# Altium schematic sheet Zigbee.SchDoc
size A3
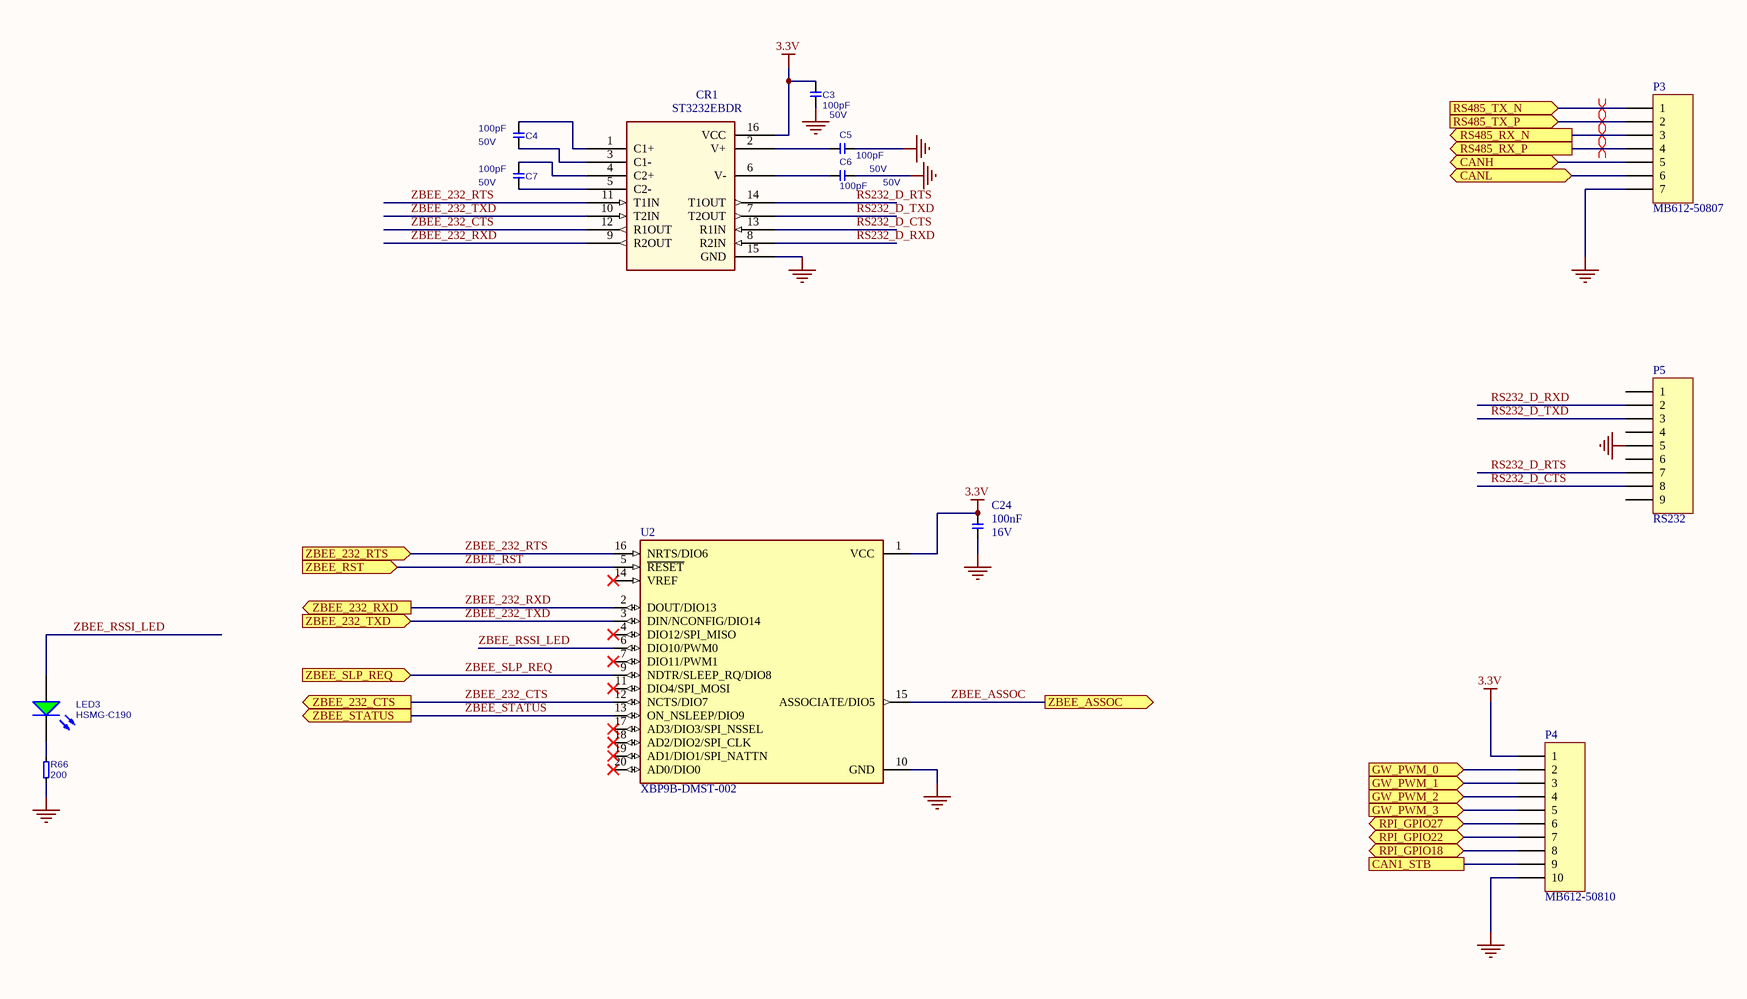
[diagram p0: Zigbee.SchDoc]

## Parts
C3  Rating: 50V  [CAPC1005X60N]  (hidden comment: 100pF)
C4  Rating: 50V  [CAPC1005X60N]  (hidden comment: 100pF)
C5  Rating: 50V  [CAPC1005X60N]  (hidden comment: 100pF)
C6  Rating: 50V  [CAPC1005X60N]  (hidden comment: 100pF)
C7  Rating: 50V  [CAPC1005X60N]  (hidden comment: 100pF)
C24  Rating: 16V  [T_CAPC0603X33N]  (hidden comment: 100nF)
CR1  ST3232EBDR  [SO-16_STM]
LED3  Manufacturer Part No.: HSMG-C190  [LEDC1608X80N]  (hidden comment: LED)
P3  MB612-50807  [MB612-50807]
P4  MB612-50810  [1729186 5.08 - 10pos]
P5  RS232  [2301843-1]
R66  200  [RESC1005X40N]
U2  XBP9B-DMST-002  [DIP2200W51P200L3294H279Q20P]

## Ports
CAN1_STB, CANH (bidir), CANL (bidir), GW_PWM_0 (in), GW_PWM_1 (in), GW_PWM_2 (in), GW_PWM_3 (in), RPI_GPIO18 (bidir), RPI_GPIO22 (bidir), RPI_GPIO27 (bidir), RS485_RX_N (out), RS485_RX_P (out), RS485_TX_N (in), RS485_TX_P (in), ZBEE_232_CTS (out), ZBEE_232_RTS (in), ZBEE_232_RXD (out), ZBEE_232_TXD (in), ZBEE_ASSOC (out), ZBEE_RST (in), ZBEE_SLP_REQ (in), ZBEE_STATUS (out)

## Nets
3.3V: C3.1 C24.2 CR1.16(VCC) P4.1 U2.1(VCC)
GND: C3.2 C5.1 C6.1 C24.1 CR1.15(GND) P3.7 P4.10 P5.5 R66.2 U2.10(GND)
CAN1_STB: P4.9 ; port CAN1_STB
CANH: P3.5 ; port CANH
CANL: P3.6 ; port CANL
GW_PWM_0: P4.2 ; port GW_PWM_0
GW_PWM_1: P4.3 ; port GW_PWM_1
GW_PWM_2: P4.4 ; port GW_PWM_2
GW_PWM_3: P4.5 ; port GW_PWM_3
RPI_GPIO18: P4.8 ; port RPI_GPIO18
RPI_GPIO22: P4.7 ; port RPI_GPIO22
RPI_GPIO27: P4.6 ; port RPI_GPIO27
RS232_D_CTS: CR1.13(R1IN) P5.8
RS232_D_RTS: CR1.14(T1OUT) P5.7
RS232_D_RXD: CR1.8(R2IN) P5.2
RS232_D_TXD: CR1.7(T2OUT) P5.3
RS485_RX_N: P3.3 ; port RS485_RX_N
RS485_RX_P: P3.4 ; port RS485_RX_P
RS485_TX_N: P3.1 ; port RS485_TX_N
RS485_TX_P: P3.2 ; port RS485_TX_P
ZBEE_232_CTS: CR1.12(R1OUT) U2.12(NCTS/DIO7) ; port ZBEE_232_CTS
ZBEE_232_RTS: CR1.11(T1IN) U2.16(NRTS/DIO6) ; port ZBEE_232_RTS
ZBEE_232_RXD: CR1.9(R2OUT) U2.2(DOUT/DIO13) ; port ZBEE_232_RXD
ZBEE_232_TXD: CR1.10(T2IN) U2.3(DIN/NCONFIG/DIO14) ; port ZBEE_232_TXD
ZBEE_ASSOC: U2.15(ASSOCIATE/DIO5) ; port ZBEE_ASSOC
ZBEE_RSSI_LED: LED3.2(A) U2.6(DIO10/PWM0)
ZBEE_RST: U2.5(~{RESET}) ; port ZBEE_RST
ZBEE_SLP_REQ: U2.9(NDTR/SLEEP_RQ/DIO8) ; port ZBEE_SLP_REQ
ZBEE_STATUS: U2.13(ON_NSLEEP/DIO9) ; port ZBEE_STATUS
NetC4_1: C4.1 CR1.3(C1-)
NetC4_2: C4.2 CR1.1(C1+)
NetC5_2: C5.2 CR1.2(V+)
NetC6_2: C6.2 CR1.6(V-)
NetC7_1: C7.1 CR1.5(C2-)
NetC7_2: C7.2 CR1.4(C2+)
NetLED3_1: LED3.1(K) R66.1

Not connected (* = marked no-connect by the designer): P5 1 4 6 9; U2 4(DIO12/SPI_MISO)* 7(DIO11/PWM1)* 11(DIO4/SPI_MOSI)* 14(VREF)* 17(AD3/DIO3/SPI_NSSEL)* 18(AD2/DIO2/SPI_CLK)* 19(AD1/DIO1/SPI_NATTN)* 20(AD0/DIO0)*

## Layout directives
differential pair: RS485_RX_N, RS485_RX_P, RS485_TX_N, RS485_TX_P

## Library data of the parts
C3-C7 = C-X7R-100pF-50V-10%-0402: Capacitor Ceramic X7R 100pF 50V 10% 0402; Tolerance: 10%; Type: X7R; Value: 100pF
C24 = C-X7R-100nF-16V-10%-0603: Capacitor Ceramic X7R 100nF 16V 10% 0603; Tolerance: 10%; Type: X7R; Value: 100nF
CR1 = ST3232EBDR: SourceLibrary: StMicro_2011-06-07; Built_By: EMA_UL_Team; Vendor: STMicroelectronics; Value: ST3232EBDR; Manufacturer_Part_Number: ST3232EBDR
LED3 = LED-Avago-HSMG-C190: Surface mount LED green 20mA; Manufacturer Name: Avago
P3 = Header 7: Header, 7-Pin; LatestRevisionDate: 17-Jul-2002; LatestRevisionNote: Re-released for DXP Platform.; Publisher: Altium Limited
P4 = Header 10: Header, 10-Pin; LatestRevisionDate: 17-Jul-2002; LatestRevisionNote: Re-released for DXP Platform.; Publisher: Altium Limited
P5 = Header 9: 2301843-1; LatestRevisionDate: 17-Jul-2002; LatestRevisionNote: Re-released for DXP Platform.; Publisher: Altium Limited
R66 = R-1KR-63mW-5%-0402: Resistor 1 Kohm 63mW 5% 0402; Value: 1K; Rating: 63mW; Tolerance: 5%
U2 = XBP9B-DMST-002: General ISM < 1GHz Transceiver Module 900MHz Antenna Not Included, RP-SMA Through Hole; MF: Digi International; Price: None; Availability: Unavailable; SnapEDA_Link: https://www.snapeda.com/parts/XBP9B-DMST-002/Digi%20International/view-part/1127866/?ref=snap; MP: XBP9B-DMST-002; Value: *; Package: Module Digiboard